# Altium schematic sheet 铁壳显示板.SchDoc
size A1
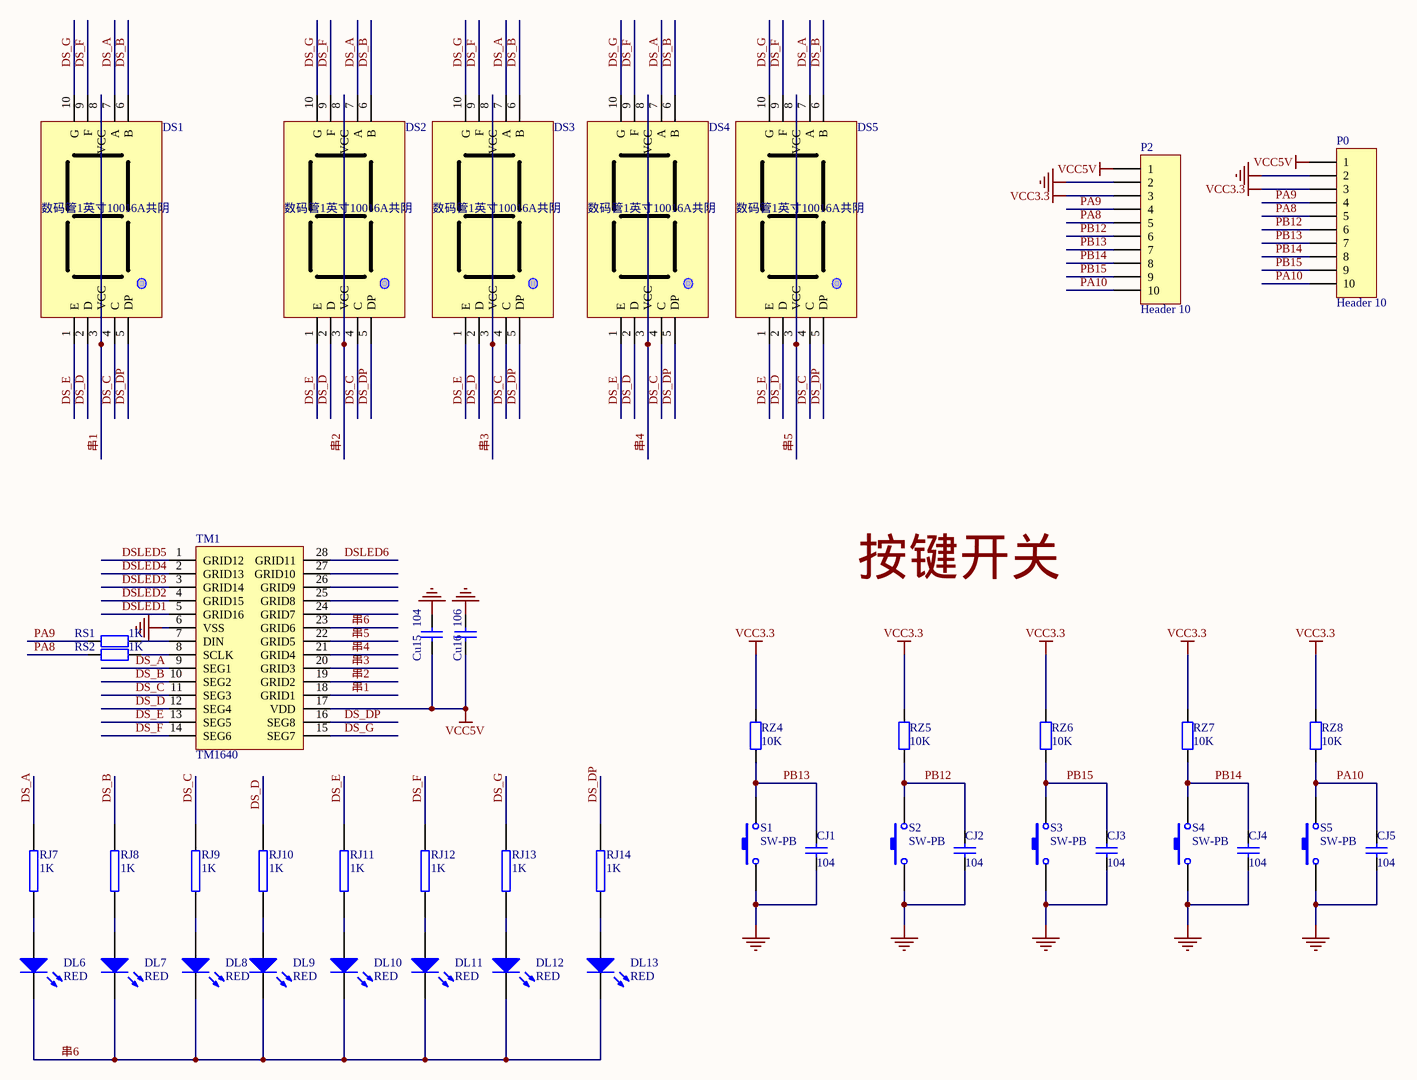
[diagram p0: 铁壳显示板.SchDoc]

## Parts
CJ1  104  [0603-1]
CJ2  104  [0603-1]
CJ3  104  [0603-1]
CJ4  104  [0603-1]
CJ5  104  [0603-1]
Cu15  104  [0603-1]
Cu16  106  [0805]
DL6  RED  [HDR1X2]
DL7  RED  [HDR1X2]
DL8  RED  [HDR1X2]
DL9  RED  [HDR1X2]
DL10  RED  [HDR1X2]
DL11  RED  [HDR1X2]
DL12  RED  [HDR1X2]
DL13  RED  [HDR1X2]
DS1  数码管1英寸10016A共阴  [1英寸1位数码管]
DS2  数码管1英寸10016A共阴  [1英寸1位数码管]
DS3  数码管1英寸10016A共阴  [1英寸1位数码管]
DS4  数码管1英寸10016A共阴  [1英寸1位数码管]
DS5  数码管1英寸10016A共阴  [1英寸1位数码管]
P0  Header 10  [HDR1X10]
P2  Header 10  [HDR1X10]
RJ7  1K  [0603-1]
RJ8  1K  [0603-1]
RJ9  1K  [0603-1]
RJ10  1K  [0603-1]
RJ11  1K  [0603-1]
RJ12  1K  [0603-1]
RJ13  1K  [0603-1]
RJ14  1K  [0603-1]
RS1  1K  [0603-1]
RS2  1K  [0603-1]
RZ4  10K  [0603-1]
RZ5  10K  [0603-1]
RZ6  10K  [0603-1]
RZ7  10K  [0603-1]
RZ8  10K  [0603-1]
S1  SW-PB  [SW_2 - SMT]
S2  SW-PB  [SW_2 - SMT]
S3  SW-PB  [SW_2 - SMT]
S4  SW-PB  [SW_2 - SMT]
S5  SW-PB  [SW_2 - SMT]
TM1  TM1640  [TM1640]

## Nets
GND: CJ1.1 CJ2.1 CJ3.1 CJ4.1 CJ5.1 Cu15.1 Cu16.2 P0.2 P2.2 S1.1 S2.1 S3.1 S4.1 S5.1 TM1.6(VSS)
VCC3.3: P0.3 P2.3 RZ4.2 RZ5.2 RZ6.2 RZ7.2 RZ8.2
VCC5V: Cu15.2 Cu16.1 P0.1 P2.1 TM1.17(VDD)
DS_A: DS1.7(A) DS2.7(A) DS3.7(A) DS4.7(A) DS5.7(A) RJ7.1 TM1.9(SEG1)
DS_B: DS1.6(B) DS2.6(B) DS3.6(B) DS4.6(B) DS5.6(B) RJ8.1 TM1.10(SEG2)
DS_C: DS1.4(C) DS2.4(C) DS3.4(C) DS4.4(C) DS5.4(C) RJ9.1 TM1.11(SEG3)
DS_D: DS1.2(D) DS2.2(D) DS3.2(D) DS4.2(D) DS5.2(D) RJ10.1 TM1.12(SEG4)
DS_DP: DS1.5(DP) DS2.5(DP) DS3.5(DP) DS4.5(DP) DS5.5(DP) RJ14.1 TM1.16(SEG8)
DS_E: DS1.1(E) DS2.1(E) DS3.1(E) DS4.1(E) DS5.1(E) RJ11.1 TM1.13(SEG5)
DS_F: DS1.9(F) DS2.9(F) DS3.9(F) DS4.9(F) DS5.9(F) RJ12.1 TM1.14(SEG6)
DS_G: DS1.10(G) DS2.10(G) DS3.10(G) DS4.10(G) DS5.10(G) RJ13.1 TM1.15(SEG7)
DSLED1: TM1.5(GRID16)
DSLED2: TM1.4(GRID15)
DSLED3: TM1.3(GRID14)
DSLED4: TM1.2(GRID13)
DSLED5: TM1.1(GRID12)
DSLED6: TM1.28(GRID11)
PA8: P0.5 P2.5 RS2.2
PA9: P0.4 P2.4 RS1.2
PA10: CJ5.2 P0.10 P2.10 RZ8.1 S5.2
PB12: CJ2.2 P0.6 P2.6 RZ5.1 S2.2
PB13: CJ1.2 P0.7 P2.7 RZ4.1 S1.2
PB14: CJ4.2 P0.8 P2.8 RZ7.1 S4.2
PB15: CJ3.2 P0.9 P2.9 RZ6.1 S3.2
串1: DS1.3(VCC) DS1.8(VCC) TM1.18(GRID1)
串2: DS2.3(VCC) DS2.8(VCC) TM1.19(GRID2)
串3: DS3.3(VCC) DS3.8(VCC) TM1.20(GRID3)
串4: DS4.3(VCC) DS4.8(VCC) TM1.21(GRID4)
串5: DS5.3(VCC) DS5.8(VCC) TM1.22(GRID5)
串6: DL6.2(K) DL7.2(K) DL8.2(K) DL9.2(K) DL10.2(K) DL11.2(K) DL12.2(K) DL13.2(K) TM1.23(GRID6)
NetDL6_1: DL6.1(A) RJ7.2
NetDL7_1: DL7.1(A) RJ8.2
NetDL8_1: DL8.1(A) RJ9.2
NetDL9_1: DL9.1(A) RJ10.2
NetDL10_1: DL10.1(A) RJ11.2
NetDL11_1: DL11.1(A) RJ12.2
NetDL12_1: DL12.1(A) RJ13.2
NetDL13_1: DL13.1(A) RJ14.2
NetRS1_1: RS1.1 TM1.7(DIN)
NetRS2_1: RS2.1 TM1.8(SCLK)

Not connected (* = marked no-connect by the designer): TM1 24(GRID7) 25(GRID8) 26(GRID9) 27(GRID10)

## Notes on the sheet
- Labels drawn without touching a wire or pin: 按键开关

## Library data of the parts
CJ1-CJ5 = 104: Capacitor; Published: 8-Jun-2000; LatestRevisionDate: 17-Jul-2002; LatestRevisionNote: Re-released for DXP Platform.; PackageReference: RAD-0.3; Publisher: Altium Limited; Value: 104
Cu15 Cu16 = Cap: Capacitor
DL6-DL13 = LED1: Typical RED GaAs LED; Published: 8-Jun-2000; LatestRevisionDate: 08-Jul-2005; LatestRevisionNote: Mech Layer 1 removed.; PackageReference: LED-1; Publisher: Altium Limited
DS1-DS5 = 数码管1英寸
P0 P2 = Header 10: Header, 10-Pin; LatestRevisionDate: 17-Jul-2002; LatestRevisionNote: Re-released for DXP Platform.; Publisher: Altium Limited
RJ7-RJ14 = RES2
RS1 RS2 = Res2: Resistor
RZ4-RZ8 = Res2: Resistor; Value: 1K; Published: 8-Jun-2000; LatestRevisionDate: 17-Jul-2002; LatestRevisionNote: Re-released for DXP Platform.; PackageReference: AXIAL-0.4; Publisher: Altium Limited
S1-S5 = SW-PB: Switch; Published: 24-Mar-1999; LatestRevisionDate: 17-Jul-2002; LatestRevisionNote: Re-released for DXP Platform.; PackageReference: SPST-2; Publisher: Altium Limited